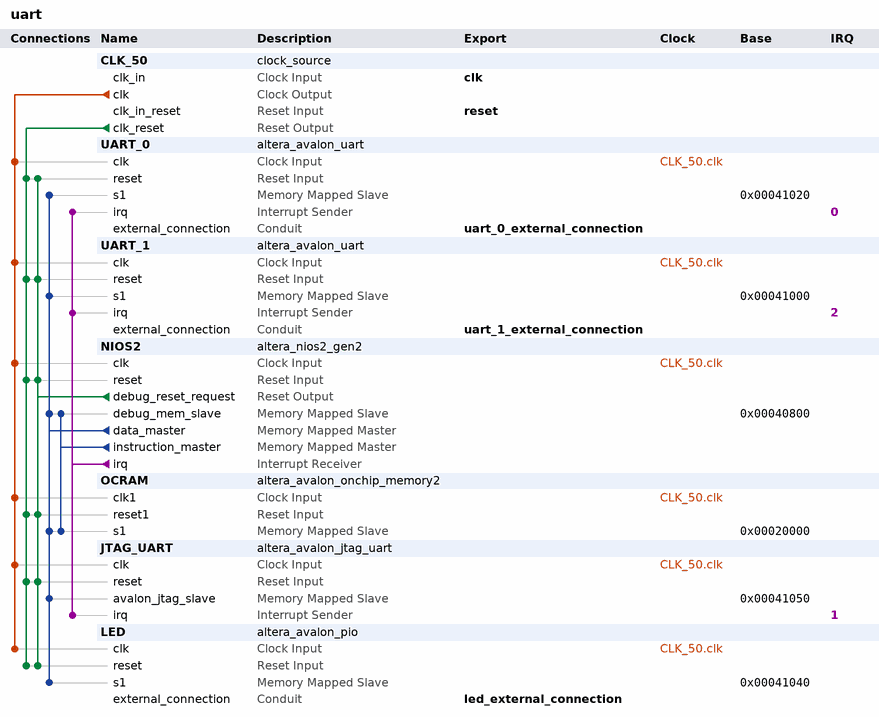
[diagram p0: system contents]
# Platform Designer (Qsys) system uart, Cyclone V 5CSEMA4U23C6
# Parameters at their usual value, and those the tool derives, are not listed.
package require -exact qsys 16.1
create_system uart
set_project_property DEVICE_FAMILY {Cyclone V}
set_project_property DEVICE 5CSEMA4U23C6

add_instance CLK_50 clock_source 16.1
set_instance_parameter_value CLK_50 clockFrequency 50000000

add_instance UART_0 altera_avalon_uart 16.1
set_instance_parameter_value UART_0 baud 115200
set_instance_parameter_value UART_0 dataBits 8
set_instance_parameter_value UART_0 fixedBaud false
set_instance_parameter_value UART_0 parity NONE
set_instance_parameter_value UART_0 stopBits 1

add_instance UART_1 altera_avalon_uart 16.1
set_instance_parameter_value UART_1 baud 115200
set_instance_parameter_value UART_1 dataBits 8
set_instance_parameter_value UART_1 fixedBaud true
set_instance_parameter_value UART_1 parity NONE
set_instance_parameter_value UART_1 stopBits 1

add_instance NIOS2 altera_nios2_gen2 16.1
set_instance_parameter_value NIOS2 dcache_size 2048
set_instance_parameter_value NIOS2 exceptionSlave OCRAM.s1
set_instance_parameter_value NIOS2 icache_size 4096
set_instance_parameter_value NIOS2 impl Tiny
set_instance_parameter_value NIOS2 resetSlave OCRAM.s1

add_instance OCRAM altera_avalon_onchip_memory2 16.1
set_instance_parameter_value OCRAM dataWidth 32
set_instance_parameter_value OCRAM dualPort false
set_instance_parameter_value OCRAM initMemContent true
set_instance_parameter_value OCRAM initializationFileName onchip_mem.hex
set_instance_parameter_value OCRAM memorySize 131072

add_instance JTAG_UART altera_avalon_jtag_uart 16.1
set_instance_parameter_value JTAG_UART simInteractiveOptions NO_INTERACTIVE_WINDOWS

add_instance LED altera_avalon_pio 16.1
set_instance_parameter_value LED direction Output
set_instance_parameter_value LED resetValue 15
set_instance_parameter_value LED width 4

# connections
add_connection CLK_50.clk JTAG_UART.clk clock
add_connection CLK_50.clk LED.clk clock
add_connection CLK_50.clk NIOS2.clk clock
add_connection CLK_50.clk OCRAM.clk1 clock
add_connection CLK_50.clk UART_0.clk clock
add_connection CLK_50.clk UART_1.clk clock
add_connection CLK_50.clk_reset JTAG_UART.reset reset
add_connection CLK_50.clk_reset LED.reset reset
add_connection CLK_50.clk_reset NIOS2.reset reset
add_connection CLK_50.clk_reset OCRAM.reset1 reset
add_connection CLK_50.clk_reset UART_0.reset reset
add_connection CLK_50.clk_reset UART_1.reset reset
add_connection NIOS2.debug_reset_request JTAG_UART.reset reset
add_connection NIOS2.debug_reset_request LED.reset reset
add_connection NIOS2.debug_reset_request NIOS2.reset reset
add_connection NIOS2.debug_reset_request OCRAM.reset1 reset
add_connection NIOS2.debug_reset_request UART_0.reset reset
add_connection NIOS2.debug_reset_request UART_1.reset reset
add_connection NIOS2.data_master JTAG_UART.avalon_jtag_slave avalon
set_connection_parameter_value NIOS2.data_master/JTAG_UART.avalon_jtag_slave baseAddress 0x00041050
add_connection NIOS2.data_master LED.s1 avalon
set_connection_parameter_value NIOS2.data_master/LED.s1 baseAddress 0x00041040
add_connection NIOS2.data_master NIOS2.debug_mem_slave avalon
set_connection_parameter_value NIOS2.data_master/NIOS2.debug_mem_slave baseAddress 0x00040800
add_connection NIOS2.data_master OCRAM.s1 avalon
set_connection_parameter_value NIOS2.data_master/OCRAM.s1 baseAddress 0x00020000
add_connection NIOS2.data_master UART_0.s1 avalon
set_connection_parameter_value NIOS2.data_master/UART_0.s1 baseAddress 0x00041020
add_connection NIOS2.data_master UART_1.s1 avalon
set_connection_parameter_value NIOS2.data_master/UART_1.s1 baseAddress 0x00041000
add_connection NIOS2.instruction_master NIOS2.debug_mem_slave avalon
set_connection_parameter_value NIOS2.instruction_master/NIOS2.debug_mem_slave baseAddress 0x00040800
add_connection NIOS2.instruction_master OCRAM.s1 avalon
set_connection_parameter_value NIOS2.instruction_master/OCRAM.s1 baseAddress 0x00020000
add_connection NIOS2.irq JTAG_UART.irq interrupt
set_connection_parameter_value NIOS2.irq/JTAG_UART.irq irqNumber 1
add_connection NIOS2.irq UART_0.irq interrupt
set_connection_parameter_value NIOS2.irq/UART_0.irq irqNumber 0
add_connection NIOS2.irq UART_1.irq interrupt
set_connection_parameter_value NIOS2.irq/UART_1.irq irqNumber 2

# exported interfaces
add_interface clk clock sink
set_interface_property clk EXPORT_OF CLK_50.clk_in
add_interface led_external_connection conduit end
set_interface_property led_external_connection EXPORT_OF LED.external_connection
add_interface reset reset sink
set_interface_property reset EXPORT_OF CLK_50.clk_in_reset
add_interface uart_0_external_connection conduit end
set_interface_property uart_0_external_connection EXPORT_OF UART_0.external_connection
add_interface uart_1_external_connection conduit end
set_interface_property uart_1_external_connection EXPORT_OF UART_1.external_connection

set_interconnect_requirement {$system} qsys_mm.clockCrossingAdapter HANDSHAKE
set_interconnect_requirement {$system} qsys_mm.enableEccProtection FALSE
set_interconnect_requirement {$system} qsys_mm.insertDefaultSlave FALSE
set_interconnect_requirement {$system} qsys_mm.maxAdditionalLatency 1

save_system uart.qsys
